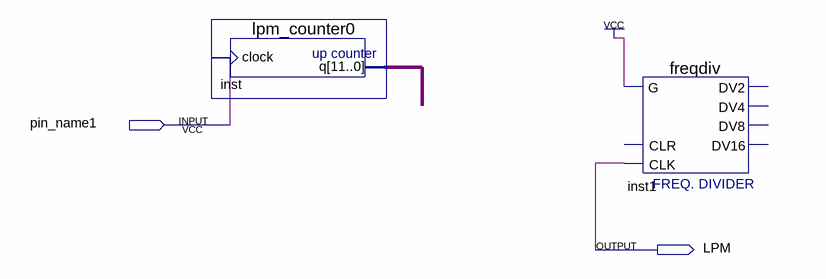
[diagram p0: schematic sheet]
// Quartus schematic Block1.bdf as structural Verilog: 2 symbols, 2 pins
module Block1 (
  input  pin_name1,
  output LPM
);

  wire [11:0] inst_q;

  lpm_counter0 inst (.clock(pin_name1), .q(inst_q));
  freqdiv inst1 (.CLK(LPM), .G(1'b1));  // open: CLR, DV2, DV4, DV8, DV16
endmodule
